# EAGLE design working (EAGLE 9.6.2)
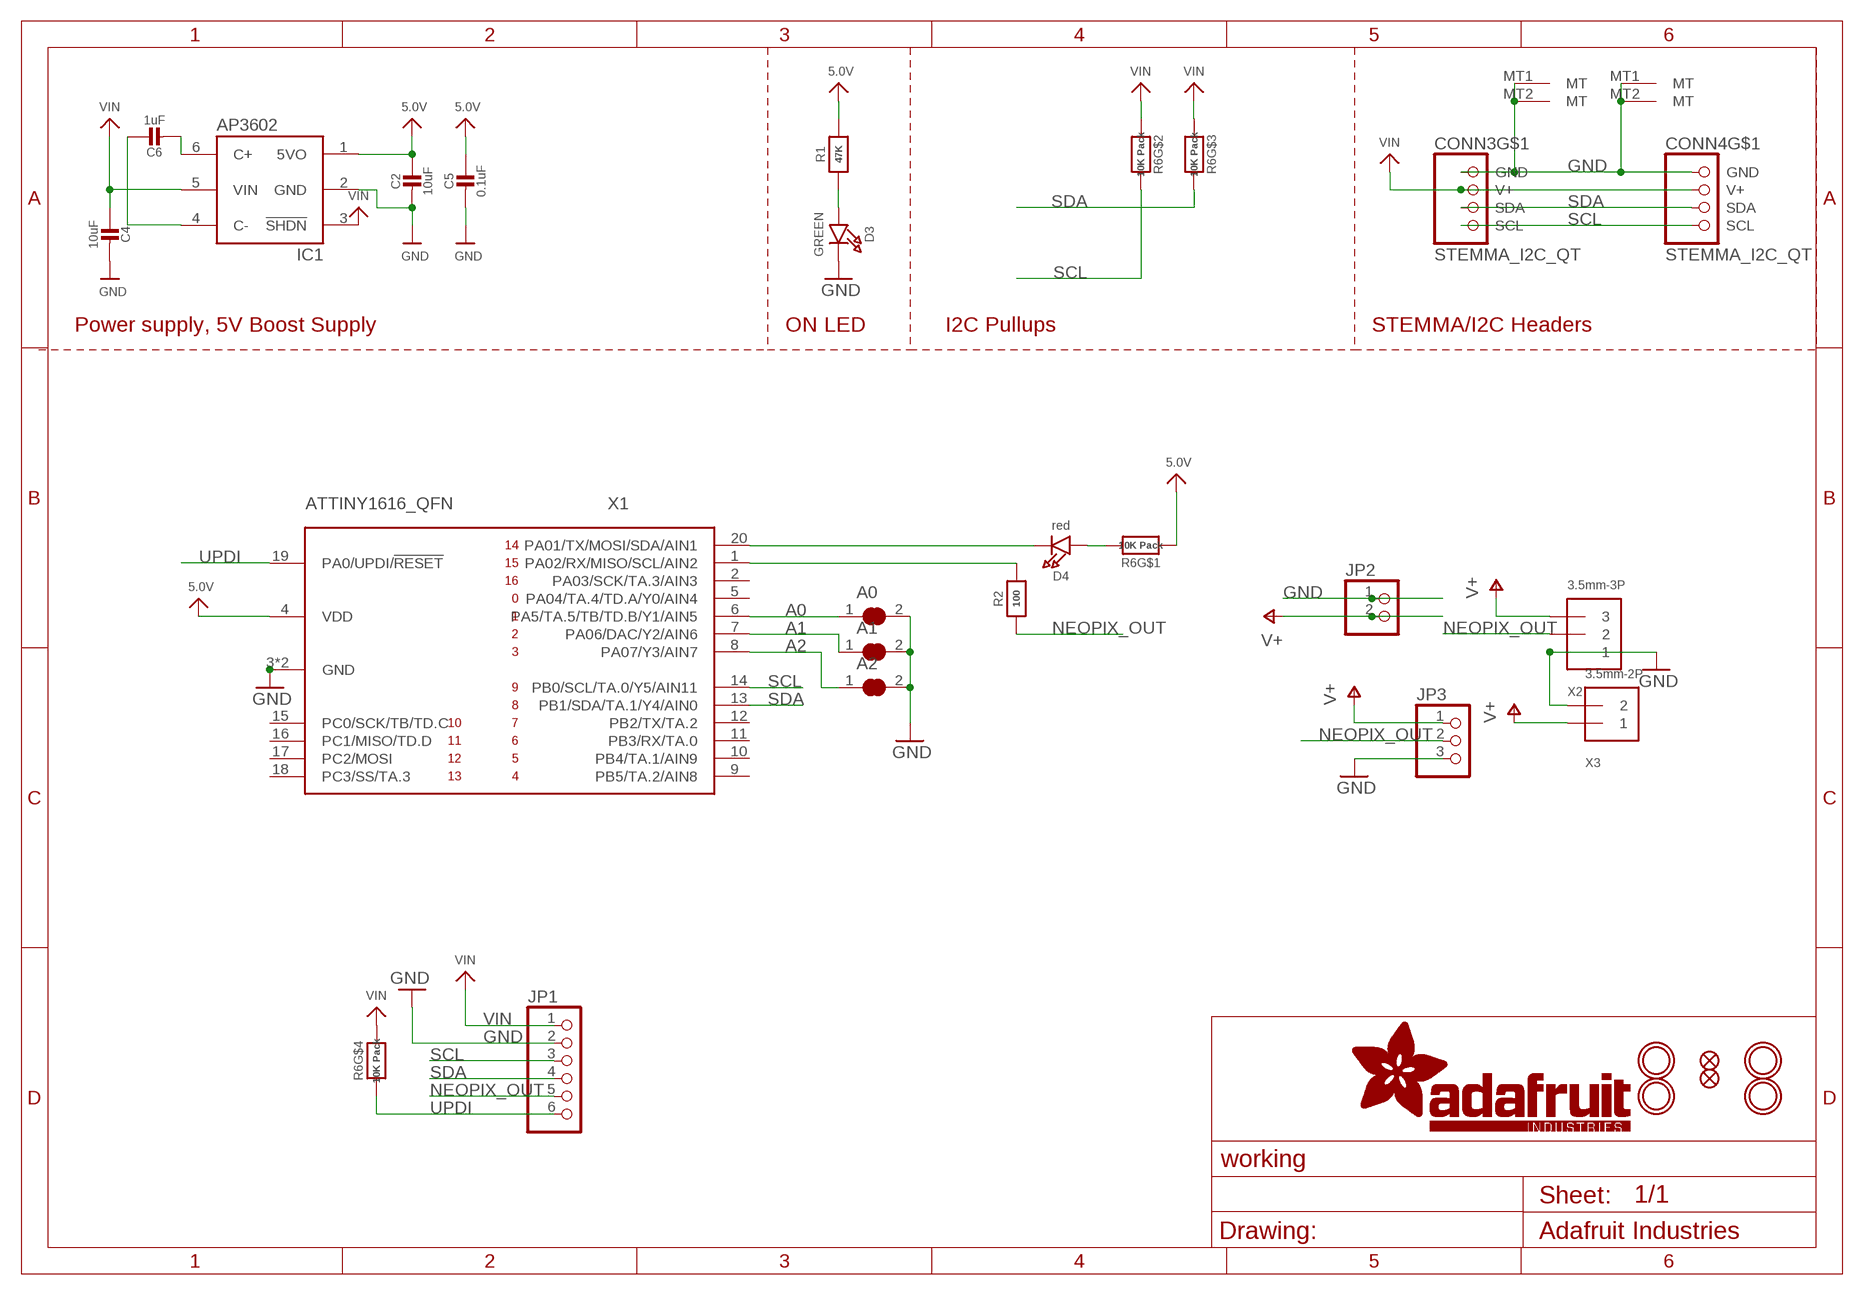
[diagram p0: schematic, sheet 1]

## Parts
A0  SOLDERJUMPER_CLOSED  [SOLDERJUMPER_CLOSEDWIRE]
A1  SOLDERJUMPER_CLOSED  [SOLDERJUMPER_CLOSEDWIRE]
A2  SOLDERJUMPER_CLOSED  [SOLDERJUMPER_CLOSEDWIRE]
C2  10uF  CAP_CERAMIC0805-NOOUTLINE  [0805-NO]
C4  10uF  CAP_CERAMIC0805-NOOUTLINE  [0805-NO]
C5  0.1uF  CAP_CERAMIC0603_NO  [0603-NO]
C6  1uF  CAP_CERAMIC0603_NO  [0603-NO]
CONN3  STEMMA_I2C_QT  [JST_SH4]
CONN4  STEMMA_I2C_QT  [JST_SH4]
D3  GREEN  LED0603_NOOUTLINE  [CHIPLED_0603_NOOUTLINE]
D4  red  LED0603_NOOUTLINE  [CHIPLED_0603_NOOUTLINE]
FID1  FIDUCIAL_1MM  [FIDUCIAL_1MM]
FID2  FIDUCIAL_1MM  [FIDUCIAL_1MM]
IC1  AP3602  [SOT23-6]
JP1  HEADER-1X670MIL  [1X06_ROUND_70]
JP2  HEADER-1X2ROUND  [1X02_ROUND]
JP3  HEADER-1X3ROUND  [1X03_ROUND]
R1  47K  RESISTOR_0603_NOOUT  [0603-NO]
R2  100  RESISTOR_0603_NOOUT  [0603-NO]
R6  10K Pack  RESISTOR_4PACK  [RESPACK_4X0603]
U$1  MOUNTINGHOLE2.5  [MOUNTINGHOLE_2.5_PLATED]
U$6  MOUNTINGHOLE2.5  [MOUNTINGHOLE_2.5_PLATED]
U$9  MOUNTINGHOLE2.5  [MOUNTINGHOLE_2.5_PLATED]
U$18  MOUNTINGHOLE2.5  [MOUNTINGHOLE_2.5_PLATED]
X1  ATTINY1616_QFN  ATTINY8X6_QFN  [QFN20_3MM]
X2  3.5mm-3P  TERMBLOCK_1X3  [TERMBLOCK_1X3-3.5MM]
X3  3.5mm-2P  TERMBLOCK_1X2_3.5MM  [TERMBLOCK_1X2-3.5MM]

## Nets
5.0V: C2.1 C5.1 IC1.1(5VO) R1.2 R6.1 X1.4(VDD)
A0: A0.1 X1.6(PA5/TA.5/TB/TD.B/Y1/AIN5)
A1: A1.1 X1.7(PA06/DAC/Y2/AIN6)
A2: A2.1 X1.8(PA07/Y3/AIN7)
ACT: D4.C X1.20(PA01/TX/MOSI/SDA/AIN1)
GND [highpower]: A0.2 A1.2 A2.2 C2.2 C4.2 C5.2 CONN3.1(GND) CONN3.MT1(MT) CONN3.MT2(MT) CONN4.1(GND) CONN4.MT1(MT) CONN4.MT2(MT) D3.C IC1.2(GND) JP1.2 JP2.1 JP3.3 X1.3(GND) X1.PAD(GND) X2.1 X3.2
N$1: D3.A R1.1
N$2: C6.2 IC1.6(C+)
N$3: C6.1 IC1.4(C-)
N$4: D4.A R6.8
N$5: R2.2 X1.1(PA02/RX/MISO/SCL/AIN2)
NEOPIX_OUT: JP1.5 JP3.2 R2.1 X2.2
SCL: CONN3.4(SCL) CONN4.4(SCL) JP1.3 R6.7 X1.14(PB0/SCL/TA.0/Y5/AIN11)
SDA: CONN3.3(SDA) CONN4.3(SDA) JP1.4 R6.6 X1.13(PB1/SDA/TA.1/Y4/AIN0)
UPDI: JP1.6 R6.4 X1.19(PA0/UPDI/!RESET)
V+ [thickpower]: JP2.2 JP3.1 X2.3 X3.1
VIN [highpower]: C4.1 CONN3.2(V+) CONN4.2(V+) IC1.3(!SHDN) IC1.5(VIN) JP1.1 R6.2 R6.3 R6.5
Unconnected: X1.2(PA03/SCK/TA.3/AIN3) X1.5(PA04/TA.4/TD.A/Y0/AIN4) X1.9(PB5/TA.2/AIN8) X1.10(PB4/TA.1/AIN9) X1.11(PB3/RX/TA.0) X1.12(PB2/TX/TA.2) X1.15(PC0/SCK/TB/TD.C) X1.16(PC1/MISO/TD.D) X1.17(PC2/MOSI) X1.18(PC3/SS/TA.3)

## Notes on the sheet
- Power supply, 5V Boost Supply | ON LED | I2C Pullups | STEMMA/I2C Headers

## Library data of the parts
A0 A1 A2 = microbuilder:SOLDERJUMPER_CLOSED: Solder Jumper - Closed These solder jumpers are closed by default CLOSEDWIRE - 10 mil trace between pads that can be cut and resoldered later CLOSEDPERM - 63 mil trace between pads for a permanent connection (used to 'bridge' two signals, a shameless hack for Eagle). Can double as a test point as well (no cream layer)
C2 C4-C6 = microbuilder:CAP_CERAMIC: Ceramic Capacitors For new designs, use the packages preceded by an '_' character since they are more reliable: The following footprints should be used on most boards: _0402 - Standard footprint for regular board layouts _0603 - Standard footprint for regular board layouts _0805 - Standard footprint for regular board layouts _1206 - Standard footprint for regular board layouts For extremely tight-pitch boards where space is at a premium, the following 'micro-pitch' footprints can be used (smaller pads, no silkscreen outline, etc.): _0402MP - Micro-pitch footprint for very dense/compact boards _0603MP - Micro-pitch footprint for very dense/compact boards _0805MP - Micro-pitch footprint for very dense/compact boards _1206MP - Micro-pitch footprint for very dense/compact boards
CONN3 CONN4 = adafruit_electromech:STEMMA_I2C; LCSC: C2845363
D3 D4 = microbuilder:LED: LED 0603 - 0603 Surface Mount Package 2mA: Green LED - Low Power (3.9mcd, 2ma, 1.7Vf) - Digikey: 475-2709-2-ND Orange LED - Low Power (9.8mcd, 2ma, 1.8Vf) - Digikey: 475-1194-2-ND Red LED - Low Power (5mcd, 2ma, 1.8Vf) - Digikey: 475-1195-2-ND Yellow LED - Low Power (7mcd, 2ma, 1.8Vf) - Digikey: 475-1196-2-ND 5mA: Blue LED - Low Power (17mcd, 5ma, 2.9Vf) - Digikey: LNJ937W8CRACT-ND 0805 - 0805 Surface Mount Package 2mA: Red LED (8.8mcd, 2mA, 1.8Vf, Clear) - Low Power [Digikey: 475-2510-1-ND] Green LED (5mcd, 2mA, 1.8Vf, Clear) - Low Power [Digikey: 475-2730-1-ND] Yellow LED (11.3mcd, 2mA, 1.8Vf, Clear) - Low Power [Digikey: 475-2555-1-ND] 20mA: Red LED (104mcd, 20mA, Diffused) - LS R976 [Digikey: 475-1278-6-ND] Red LED (12mcd, 20mA, 2.0Vf, Clear) - APT2012EC [Digikey: 754-1128-1-ND] Green LED (15mcd, 20mA, 2.2Vf, Clear) - APT2012GC [Digikey: 754-1131-1-ND] Orange LED (160mcd, 20mA, 2.1Vf, Clear) - APT2012SECK [Digikey: 754-1130-1-ND] 1206 - 1206 Surface Mount Package Green LED (26mcd, 20mA, Diffused) - LG N971 [Digikey: 475-1407-6-ND] Red LED (15mcd, 20mA, Diffused) - LH N974 [Digikey: 475-1416-6-ND] Cree - Cree High-Power Surface Mount LEDs XPEBWT-L1-0000-00D50 - White 111lm 350mA 2.9Vf 6200K 110° XTEAWT-00-0000-00000LEE3 - White 114lm 350mA 2.85Vf 5000K 115° Everlight - Everlight 45-21 Series Surface Mount LEDs 45-21/QK2C-B2832AC2CB2/2T - Warm White 2000mcd 20mA 3.25Vf 3050K 120° 45-21/LK2C-B38452C4CB2/2T - Nuetral White 2000mcd 20mA 3.25Vf 4150K 120° 45-21/LK2C-B50634C6CB2/2T - Cold White 2200mcd 20mA 3.25Vf 5650K 120° PLCC2 Reverse Mount LS T77K-J1L2-1-0-2-R18-Z - Red 11.25mcd 2mA 1.8Vf 630nm 120° LO T77K-L1M2-24-Z - Orange 19.6mcd 2mA 1.8Vf 606nm 120° LY T77K-K2M1-26-Z - Yellow 15.7mcd 2mA 1.8Vf 587nm 120°; ROT: 270
FID1 FID2 = microbuilder:FIDUCIAL: Fiducial Alignment Points Various fiducial points for machine vision alignment.; BOM: EXCLUDE
IC1 = microbuilder:AP3602
JP1 = microbuilder:HEADER-1X6: PIN HEADER
JP2 = microbuilder:HEADER-1X2: PIN HEADER
JP3 = microbuilder:HEADER-1X3: PIN HEADER
R1 R2 = microbuilder:RESISTOR: Resistors For new designs, use the packages preceded by an '_' character since they are more reliable: The following footprints should be used on most boards: _0402 - Standard footprint for regular board layouts _0603 - Standard footprint for regular board layouts _0805 - Standard footprint for regular board layouts _1206 - Standard footprint for regular board layouts For extremely tight-pitch boards where space is at a premium, the following 'micro-pitch' footprints can be used (smaller pads, no silkscreen outline, etc.): _0402MP - Micro-pitch footprint for very dense/compact boards _0603MP - Micro-pitch footprint for very dense/compact boards _0805MP - Micro-pitch footprint for very dense/compact boards _1206MP - Micro-pitch footprint for very dense/compact boards
R6 = microbuilder:RESISTOR_4PACK: Resistor Packs (4 resistors) 4 x 0603 10K 1/16W - Digikey: YC164J-10KCT-ND
U$1 U$6 U$9 U$18 = adafruit_electromech:MOUNTINGHOLE: Mounting Hole For #2 screws (0.086"/2.18mm width, 0.094"/2.4mm hole) use 2.5mm; BOM: EXCLUDE
X1 = adafruit_micro:ATTINY8X6
X2 = adafruit_electromech:TERMBLOCK_1X3: 3.5mm Terminal block http://www.ladyada.net/library/pcb/eaglelibrary.html
X3 = adafruit_electromech:TERMBLOCK_1X2: 3.5mm Terminal block http://www.ladyada.net/library/pcb/eaglelibrary.html

## Net classes
1 highpower: width 0.254 mm, drill 0.483 mm
2 thickpower: width 0.406 mm

## Board
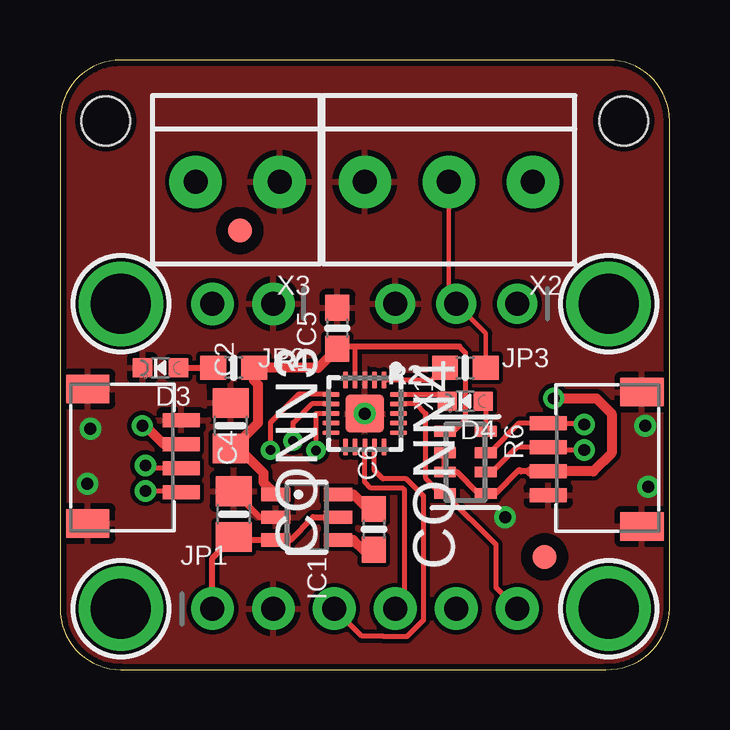
[diagram p1: board, top side]
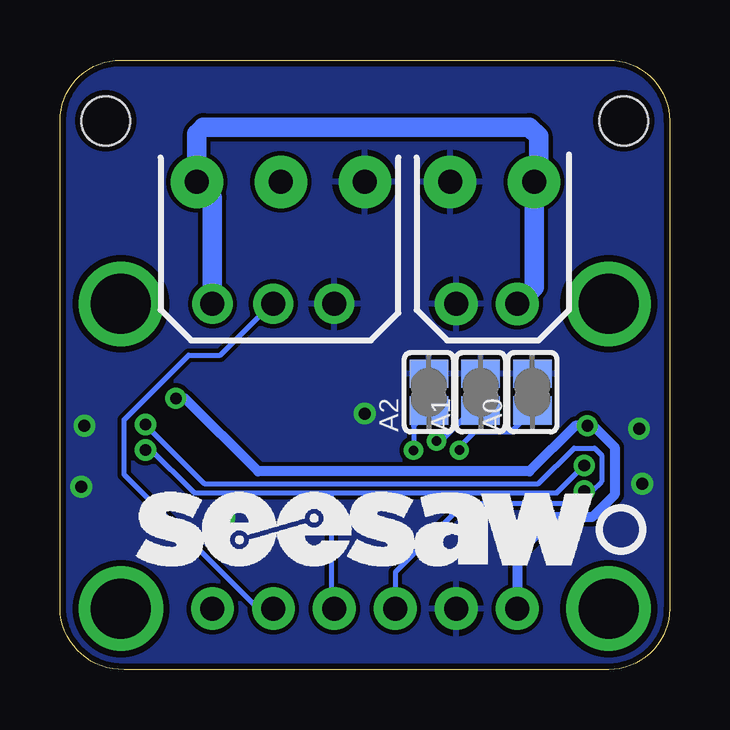
[diagram p2: board, bottom side, seen from below]

Size 25.4 x 25.4 mm. Coordinates in mm from the lower left corner, seen from the top.
Outline: 25.4,2.54 25.4,22.86 arc90 22.86,25.4 2.54,25.4 arc90 0,22.86 0,2.54 arc90 2.54,0 22.73,0 arc90 25.4,2.54
Copper layers (1*16): Top 0.035mm / dielectric 1.5mm / Bottom 0.035mm
Design rules "adafruit 7-7": minimum track width 7mil, minimum drill 15.5mil, track to track 7mil, track to pad 7mil, pad to pad 7mil, via to via 7mil, smd to smd 7mil, copper to edge 10mil, drill to drill 8mil, minimum pad ring 10mil, minimum via ring 8mil, stop-mask expansion 2mil, vias tented up to drill 20mil, thermal gap 10mil
Holes 2.03 mm at 1.91,22.86 23.5,22.86

### Footprints (pad centres in the part's own frame; a part is rotated, then mirrored left to right if it is on the bottom)
SOLDERJUMPER_CLOSEDWIRE = smd 1.168 x 1.6: 1 -0.762,0; 2 0.762,0 | smd 0.635 x 0.203: WIRE 0,0
0805-NO = smd 1.24 x 1.5: 1 -0.95,0; 2 0.95,0
0603-NO = smd 1.075 x 1: 1 -0.85,0; 2 0.85,0
JST_SH4 = smd 0.6 x 1.55: 1 -1.5,2.006; 2 -0.5,2.006; 3 0.5,2.006; 4 1.5,2.006 | smd 1.2 x 1.8: MT1 -2.8,-1.894; MT2 2.8,-1.894
CHIPLED_0603_NOOUTLINE = smd 0.8 x 0.8: A 0,-0.75; C 0,0.75
FIDUCIAL_1MM = smd 1 x 1: 1 0,0
SOT23-6 = smd 0.55 x 1.2: 1 -0.95,-1.3; 2 0,-1.3; 3 0.95,-1.3; 4 0.95,1.3; 5 0,1.3; 6 -0.95,1.3
1X06_ROUND_70 = drill 1 pad 1.778: 1 -6.35,0; 2 -3.81,0; 3 -1.27,0; 4 1.27,0; 5 3.81,0; 6 6.35,0
1X02_ROUND = drill 1 pad 1.778: 1 -1.27,0; 2 1.27,0
1X03_ROUND = drill 1 pad 1.676: 1 -2.54,0; 2 0,0; 3 2.54,0
RESPACK_4X0603 = smd 0.45 x 0.9: 1 -1.3,-0.85; 2 -0.4,-0.85; 3 0.4,-0.85; 4 1.3,-0.85; 5 1.3,0.85; 6 0.4,0.85; 7 -0.4,0.85; 8 -1.3,0.85
MOUNTINGHOLE_2.5_PLATED = drill 2.5 pad 3.2: P$1 0,0
QFN20_3MM = smd 0.7 x 0.2: 1 -1.4,0.8; 2 -1.4,0.4; 3 -1.4,0; 4 -1.4,-0.4; 5 -1.4,-0.8; 11 1.4,-0.8; 12 1.4,-0.4; 13 1.4,0; 14 1.4,0.4; 15 1.4,0.8 | smd 0.2 x 0.7: 6 -0.8,-1.4; 7 -0.4,-1.4; 8 0,-1.4; 9 0.4,-1.4; 10 0.8,-1.4; 16 0.8,1.4; 17 0.4,1.4; 18 0,1.4; 19 -0.4,1.4; 20 -0.8,1.4 | smd 1.6 x 1.6: PAD 0,0
TERMBLOCK_1X3-3.5MM = drill 1 pad 2.184: 1 3.5,0; 2 0,0; 3 -3.5,0
TERMBLOCK_1X2-3.5MM = drill 1 pad 2.184: 1 1.8,0; 2 -1.7,0

### Placement (x,y rotation side)
A0  5.71,11.56 90 bottom
A1  7.87,11.56 90 bottom
A2  10.03,11.56 90 bottom
C2  7.11,10.16 90 top
C4  7.24,6.48 90 top
C5  11.56,14.22 90 top
C6  13.08,5.84 90 top
CONN3  3.05,8.89 270 top
CONN4  22.35,8.76 90 top
D3  4.19,12.57 90 top
D4  16.89,11.18 90 top
FID1  20.19,4.7 90 top
FID2  7.49,18.29 90 top
IC1  10.29,6.35 270 top
JP1  12.7,2.54 0 top
JP2  7.62,15.24 180 top
JP3  16.51,15.24 180 top
PLABEL0  [PLABEL0]  6.35,4.19 0 top
PLABEL1  [PLABEL1]  8.89,0.89 0 top
PLABEL2  [PLABEL2]  11.43,4.19 0 top
PLABEL3  [PLABEL3]  14.1,0.89 0 top
PLABEL4  [PLABEL4]  16.51,4.19 0 top
PLABEL5  [PLABEL5]  19.05,0.89 0 top
PLABEL6  [PLABEL6]  6.35,13.72 0 top
PLABEL7  [PLABEL7]  8.89,13.72 0 top
PLABEL8  [PLABEL8]  13.84,13.72 0 top
PLABEL9  [PLABEL9]  19.3,13.72 0 top
PLABEL10  [PLABEL10]  16.64,13.72 0 top
PLABEL11  [PLABEL11]  2.29,19.56 0 top
PLABEL12  [PLABEL12]  23.11,19.81 0 top
PLABEL13  [PLABEL13]  4.32,24.26 0 top
PLABEL14  [PLABEL14]  14.99,24.26 0 top
PLABEL15  [PLABEL15]  19.18,24.26 0 top
PLABEL16  [PLABEL16]  7.37,24.26 0 top
PLABEL17  [PLABEL17]  11.43,24.26 0 top
PLABEL18  [PLABEL18]  10.92,8.76 0 bottom
PLABEL19  [PLABEL19]  8.64,8.64 0 bottom
PLABEL20  [PLABEL20]  6.48,8.64 0 bottom
PLABEL21  [PLABEL21]  24.77,8.76 0 bottom
PLABEL22  [PLABEL22]  19.18,21.59 90 bottom
PLABEL23  [PLABEL23]  15.62,21.59 90 bottom
PLABEL24  [PLABEL24]  12.19,21.59 90 bottom
PLABEL25  [PLABEL25]  8.64,21.59 90 bottom
PLABEL26  [PLABEL26]  5.21,21.59 90 bottom
PLABEL27  [PLABEL27]  7.37,17.65 0 bottom
PLABEL28  [PLABEL28]  15.88,17.78 0 bottom
PLABEL29  [PLABEL29]  12.06,1.02 0 bottom
R1  7.24,12.57 0 top
R2  16.89,12.57 180 top
R6  16.89,8.64 270 top
U$1  2.54,15.24 0 top
U$6  2.54,2.54 0 top
U$7  [SEESAW_LOGO]  22.23,4.32 0 bottom
U$9  22.86,15.24 0 top
U$12  [PCBFEAT-REV-040]  2.03,5.84 180 bottom
U$18  22.86,2.54 0 top
X1  12.7,10.67 270 top
X2  16.2,20.32 180 top
X3  7.45,20.32 180 top

### Tracks (layer width: path | path; a pad name or v marks a point on that pad's centre or on a via)
5.0V
  Top 0.203: R6.1 16.41,9.94 16.89,10.41 16.89,13.21 16.64,13.46 | X1.4 12.3,13.44 12.32,13.46
  Top 0.254: C5.1 11.64,13.46 12.32,13.46 16.64,13.46
  Top 0.406: 7.24,9.21 7.46,9.21 8.48,8.19 8.48,7.81 IC1.1 | 7.24,9.21 C2.1 | C5.1 10.76,12.57 R1.2 8.09,12.04 8.24,11.89 8.24,10.28 7.24,9.27 7.24,9.21
A0  (via drill 0.39)
  Top 0.203: X1.6 9.94,11.47 8.76,10.29 v8.76,9.14
  Bottom 0.203: v8.76,9.14 8.76,9.27 8.13,9.91 6.6,9.91 A0.1
A1  (via drill 0.39)
  Top 0.203: X1.7 10.49,11.07 9.71,10.29 v9.71,9.53
  Bottom 0.203: v9.71,9.53 9.53,9.53 8.26,10.79 A1.1
A2  (via drill 0.39)
  Top 0.203: X1.8 10.67,10.67 v10.67,9.14
  Bottom 0.203: v10.67,9.14 10.67,10.16 A2.1
ACT
  Top 0.203: D4.C 16,11.18 15.71,11.47 X1.20
GND  (via drill 0.5)
  Top 0.254: IC1.2 8.32,6.35 C4.2
  other vias: 12.7,10.67 1.27,10.03 1.14,7.75 24.38,10.16 24.51,7.62 18.54,6.35
  pour Top: 0,25.4 25.4,25.4 25.4,0 0,0
  pour Bottom: 0,25.4 25.4,25.4 25.4,0 0,0
N$1
  Top 0.254: D3.A R1.1
N$2
  Top 0.406: IC1.6 12.22,7.3 12.73,6.79 C6.2
N$3
  Top 0.406: IC1.4 12.22,5.4 12.73,4.89 13.08,4.89 C6.1
N$4
  Top 0.203: D4.A 17.74,11.08 R6.8
N$5
  Top 0.203: R2.2 16.02,12.59 15.5,12.07 X1.1
NEOPIX_OUT
  Top 0.178: R2.1 17.74,14.01 JP3.2 16.2,15.55 X2.2
  Bottom 0.203: JP1.5 17.14,2.54 22.73,8.13 22.73,10.41 20.04,13.11 18.71,13.11 16.58,15.24 JP3.2
SCL  (via drill 0.48)
  Top 0.203: v21.84,10.21 21.79,10.26 CONN4.4 19.11,10.26 18.53,9.68 18.53,9.65 17.91,9.04 R6.7 | v3.56,7.44 5.51,7.44 CONN3.4 | JP1.3 12.57,1.4 13.46,1.4 13.49,1.37 14.45,1.37 15.14,2.06 15.14,7.24 14.44,7.95 13.46,7.95 13.1,8.3 X1.14
  Bottom 0.203: v21.84,10.21 19.38,7.75 5.47,7.75 3.98,9.23 3.13,9.23 2.83,8.94 2.83,7.83 3.22,7.44 v3.56,7.44 4.06,6.93 8.56,6.93 11.43,4.06 JP1.3
SDA  (via drill 0.48)
  Top 0.203: CONN3.3 3.67,8.39 v3.56,8.51 | v21.84,9.14 19.96,9.14 CONN4.3 19.04,9.26 18.01,8.24 R6.6 | JP1.4 14.35,2.92 14.35,7.49 14.28,7.56 12.96,7.56 12.7,7.82 X1.13
  Bottom 0.203: 14.1,7.37 4.7,7.37 v3.56,8.51 | v21.84,9.14 21.72,9.27 19.81,7.37 14.1,7.37 | 14.1,7.37 14.1,2.67 JP1.4
UPDI
  Top 0.203: JP1.6 18.16,3.43 18.16,5.22 R6.4 15.87,7.34 15.24,7.97 15.24,10.67 14.84,11.07 X1.19
V+
  Bottom 0.813: JP3.1 19.05,19.67 X2.3 19.7,22.34 19.43,22.61 5.84,22.61 5.46,22.23 5.46,20.51 X3.1 5.65,15.94 JP2.2
VIN  (via drill 0.48)
  Top 0.254: CONN4.2 19.2,8.26 19.14,8.33 18.15,7.34 R6.5 17.43,7.34 16.53,8.24 R6.3 R6.2 | JP1.1 6.35,4.64 C4.1 7.37,5.4 IC1.3 9.59,5.4 10.54,6.35 IC1.5
  Top 0.406: CONN3.2 4.33,9.39 3.56,10.16 v3.43,10.16 | v20.57,11.3 22.35,11.3 22.99,10.67 22.99,9.02 22.23,8.26 19.59,8.26 19.6,8.25 CONN4.2
  Bottom 0.406: JP1.1 6.35,4.83 4.83,6.35 3.23,6.35 2.29,7.29 2.29,9.27 3.17,10.16 v3.43,10.16 3.94,10.16 5.84,8.26 17.14,8.26 20.19,11.3 v20.57,11.3

### Text on the board
Pinguin_tBackup: 5V | GND | GND | Data | 5V | Neo / Pixel / Out | 5V / DC | 5V | GND | G | NEO | 5V | VIN | SCL | NEO | GND | SDA | UPDI
Pinguin_bBackup: 5Vin | GND | GND | Sig. | 5Vo | Power / Input | Power & / Signal Out | A0 | A1 | A2 | I2C NeoPixel / Driver | Vin/Vlogic:3-5VDC